# EAGLE schematic Zigzag 6p ATtiny connector (EAGLE 7.6.0)
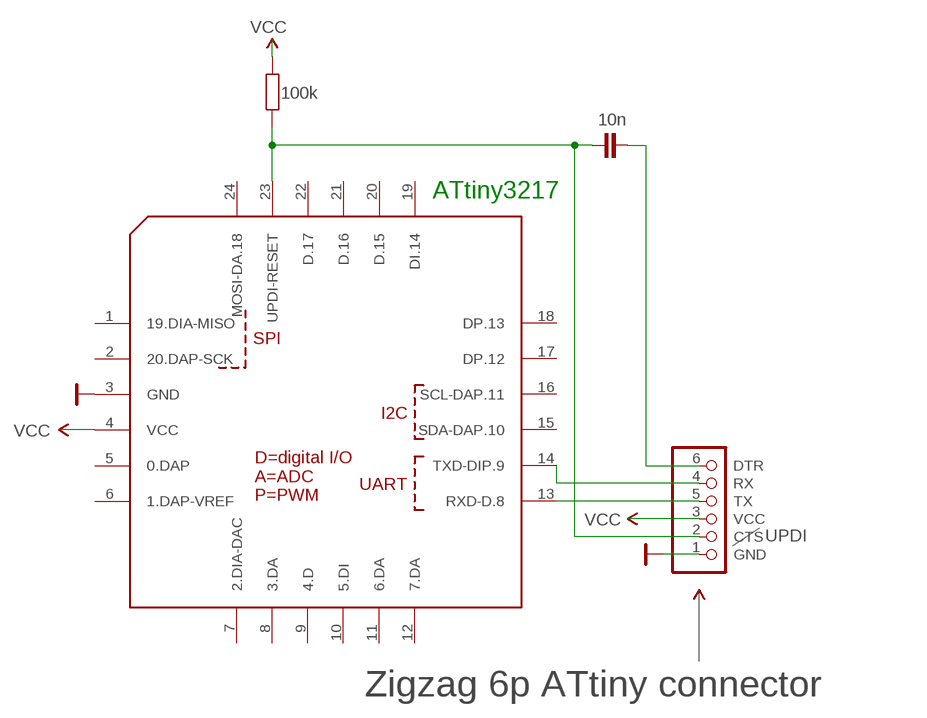
[diagram p0: schematic, sheet 1]
V1 (ARROW): VALUE: x
V3 (ARROW): VALUE: x
V4 (ARROW): VALUE: x
V8 (ARROW): VALUE: x

## Parts
C2  10n  SMD-C-0603-SMALL  [0603-SMALL]
J2  FTDI  [ZIGZAG-FTDI]
R2  100k  SMD-R0603-S  [0603-SMALL]
U1  ATTINY3217-  [QFN-24]

## Nets
GND: J2.1(GND) U1.3(GND)
N$6: C2.2 J2.6(DTR)
N$7: J2.4(RX) U1.14(TXD-DIP.9)
N$8: J2.5(TX) U1.13(RXD-D.8)
UPDI: C2.1 J2.2(CTS) R2.1 U1.23(UPDI-RESET)
VCC: J2.3(VCC) R2.2 U1.4(VCC)
Unconnected: U1.1(19.DIA-MISO) U1.2(20.DAP-SCK) U1.5(0.DAP) U1.6(1.DAP-VREF) U1.7(2.DIA-DAC) U1.8(3.DA) U1.9(4.D) U1.10(5.DI) U1.11(6.DA) U1.12(7.DA) U1.15(SDA-DAP.10) U1.16(SCL-DAP.11) U1.17(DP.12) U1.18(DP.13) U1.19(DI.14) U1.20(D.15) U1.21(D.16) U1.22(D.17) U1.24(MOSI-DA.18)

## Notes on the sheet
- ATtiny3217
- Zigzag 6p ATtiny connector

## Library data of the parts
C2 = Albert:SMD-C: Capacitors
J2 = Albert:FTDI
R2 = Albert:SMD-R: Resistor
U1 = Albert-Arduino:ATTINY3217: MICROCONTROLLER 4 Kbytes FLASH 128 bytes SRAM 256 bytes EEPROM UART 6-channel 10 bit ADC